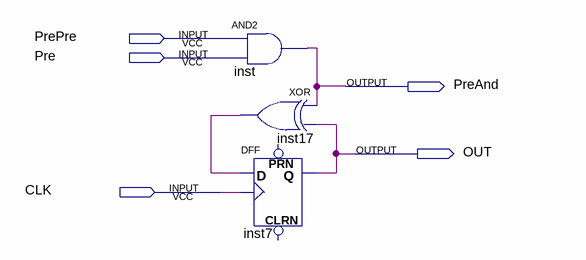
[diagram p0: schematic sheet]
// Quartus schematic Dff2.bdf as structural Verilog: 3 symbols, 5 pins
module Dff2 (
  input  PrePre,
  input  Pre,
  input  CLK,
  output PreAnd,
  output OUT
);

  wire inst17_out;

  and inst (PreAnd, PrePre, Pre);
  xor inst17 (inst17_out, PreAnd, OUT);
  DFF inst7 (.CLK(CLK), .D(inst17_out), .Q(OUT));  // open: CLRN, PRN
endmodule
